# Altium schematic sheet A1.SchDoc: Название платы
size 840 x 594 mm; ApprovedBy: Рогов; CheckedBy: Фамилия проверяющего; DrawnBy: Фамилия разработчика; DocumentNumber: Введите номер платы + Э3; SheetNumber: пусто если лист 1, иначе 1; SheetTotal: количество листов; Title1str: (вторая строка при необходимости); DocumentType: тип схемы; Format: A1; ImagePath: Введите номер платы
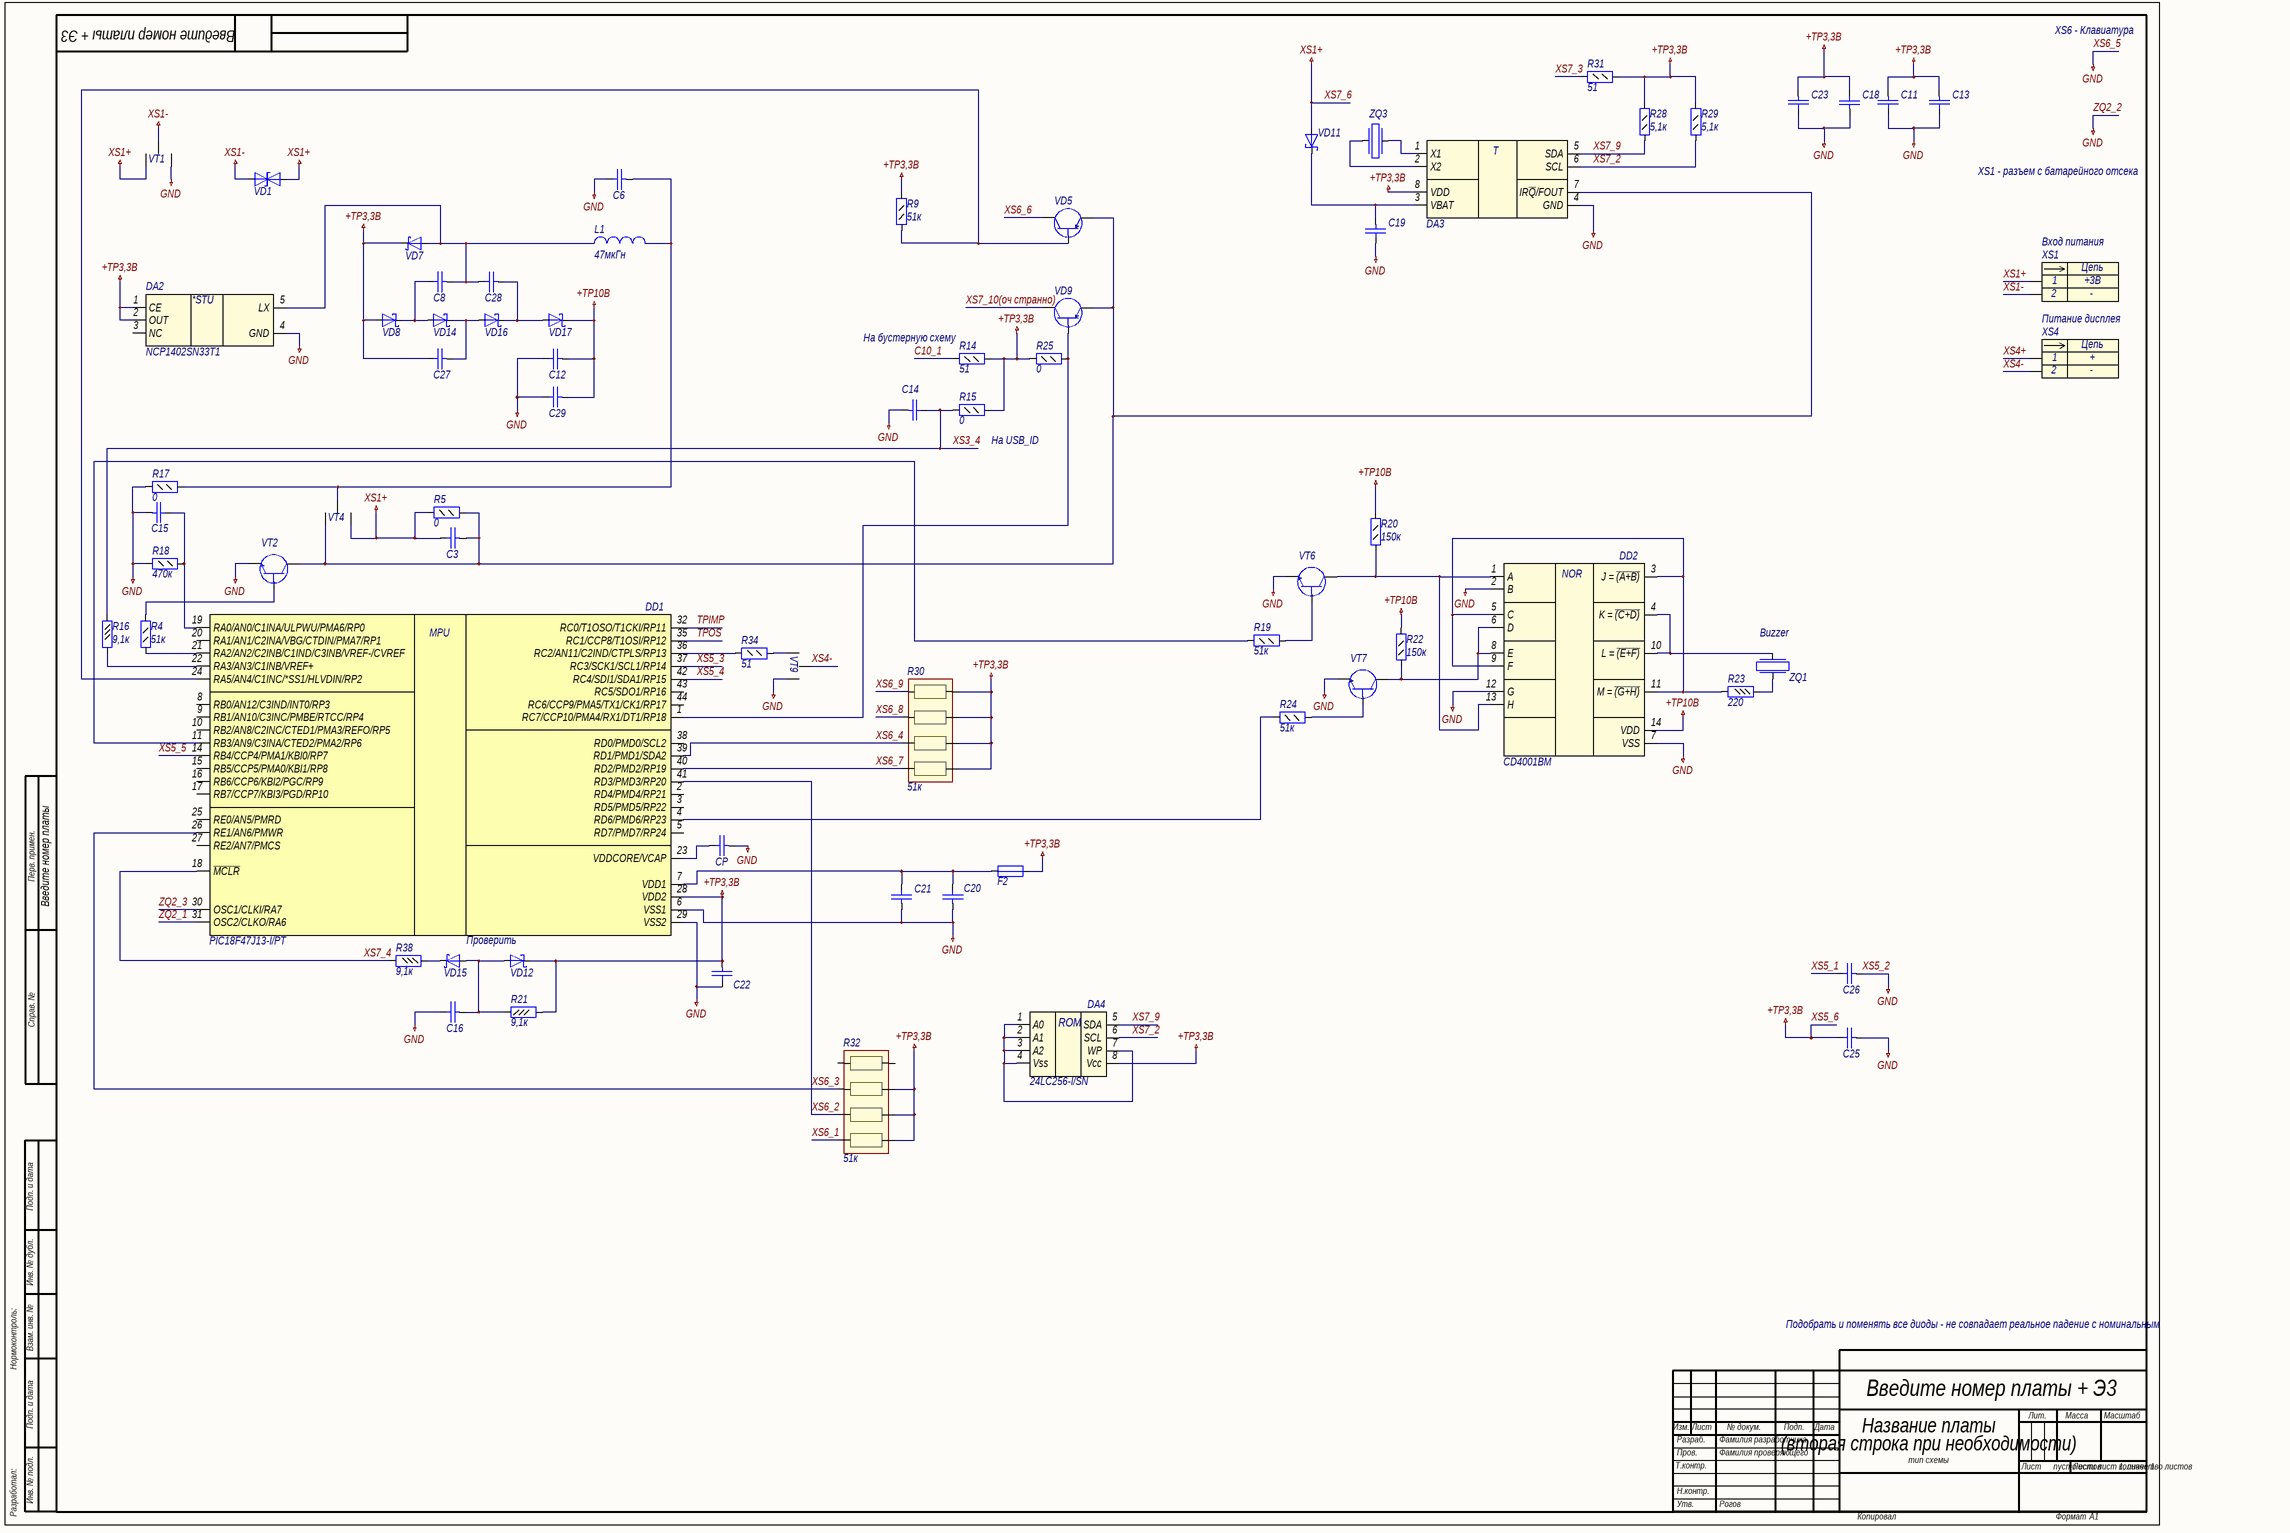
[diagram p0: A1.SchDoc]

## Parts
C3  Capacitor  [C0402]  (value not drawn)
C6  Capacitor  [C0402]  (value not drawn)
C8  Capacitor  [C0402]  (value not drawn)
C11  Capacitor  [C0402]  (value not drawn)
C12  Capacitor  [C0402]  (value not drawn)
C13  Capacitor  [C0402]  (value not drawn)
C14  Capacitor  [C0402]  (value not drawn)
C15  Capacitor  [C0402]  (value not drawn)
C16  Capacitor  [C0402]  (value not drawn)
C18  Capacitor  [C0402]  (value not drawn)
C19  Capacitor  [C0402]  (value not drawn)
C20  Capacitor  [C0402]  (value not drawn)
C21  Capacitor  [C0402]  (value not drawn)
C22  Capacitor  [C0402]  (value not drawn)
C23  Capacitor  [C0402]  (value not drawn)
C25  Capacitor  [C0402]  (value not drawn)
C26  Capacitor  [C0402]  (value not drawn)
C27  Capacitor  [C0402]  (value not drawn)
C28  Capacitor  [C0402]  (value not drawn)
C29  Capacitor  [C0402]  (value not drawn)
CP  Capacitor  [C0402]  (value not drawn)
DA2  Part Number: NCP1402SN33T1  [SOT23-5]  (hidden comment: NCP1402)
DA3  ISL1208IB8Z  [SO8]  (value not drawn)
DA4  24LC256-I/SN  [SO8]
DD1  PIC18F47J13-I/PT  [TQFP-44]
DD2  CD4001BM  [SO14]
F2  Fuse  [FUSE812]  (value not drawn)
L1  value 47мкГн  [SDR0604]  (hidden comment: Inductor)
R4  value 51к  [R0805]  (hidden comment: Resistor_0,125Вт)
R5  value 0  [R0805]  (hidden comment: Resistor_0,125Вт)
R9  value 51к  [R0805]  (hidden comment: Resistor_0,125Вт)
R14  value 51  [R0805]  (hidden comment: Resistor_0,125Вт)
R15  value 0  [R0805]  (hidden comment: Resistor_0,125Вт)
R16  value 9,1к  [R0603]  (hidden comment: Resistor_0,062Вт)
R17  value 0  [R0805]  (hidden comment: Resistor_0,125Вт)
R18  value 470к  [R0805]  (hidden comment: Resistor_0,125Вт)
R19  value 51к  [R0805]  (hidden comment: Resistor_0,125Вт)
R20  value 150к  [R0805]  (hidden comment: Resistor_0,125Вт)
R21  value 9,1к  [R0603]  (hidden comment: Resistor_0,062Вт)
R22  value 150к  [R0805]  (hidden comment: Resistor_0,125Вт)
R23  value 220  [R0603]  (hidden comment: Resistor_0,062Вт)
R24  value 51к  [R0805]  (hidden comment: Resistor_0,125Вт)
R25  value 0  [R0805]  (hidden comment: Resistor_0,125Вт)
R28  value 5,1к  [R0805]  (hidden comment: Resistor_0,125Вт)
R29  value 5,1к  [R0805]  (hidden comment: Resistor_0,125Вт)
R30  value 51к  [4xR1206]  (hidden comment: Resistors_array_4x0,062Вт)
R31  value 51  [R0805]  (hidden comment: Resistor_0,125Вт)
R32  value 51к  [4xR1206]  (hidden comment: Resistors_array_4x0,062Вт)
R34  value 51  [R0805]  (hidden comment: Resistor_0,125Вт)
R38  value 9,1к  [R0603]  (hidden comment: Resistor_0,062Вт)
VD1  DiodeZenerDual  [SMB]  (value not drawn)
VD5  BJT PNP  [SOT23-3]  (value not drawn)
VD7  DiodeSchottky  [SOD-123]  (value not drawn)
VD8  DiodeSchottky  [SOD-123]  (value not drawn)
VD9  BJT PNP  [SOT23-3]  (value not drawn)
VD11  DiodeSchottky  [SOD-123]  (value not drawn)
VD12  DiodeSchottky  [SOD-123]  (value not drawn)
VD14  DiodeSchottky  [SOD-123]  (value not drawn)
VD15  DiodeSchottky  [SOD-123]  (value not drawn)
VD16  DiodeSchottky  [SOD-123]  (value not drawn)
VD17  DiodeSchottky  [SOD-123]  (value not drawn)
VT2  BJT NPN  [SOT23-3]  (value not drawn)
VT6  BJT NPN  [SOT23-3]  (value not drawn)
VT7  BJT NPN  [SOT23-3]  (value not drawn)
XS1  Вход питания  [CWF-2]
XS4  Питание дисплея  [CWF-2]
ZQ1  (no value)  [Buzzer_9mm]
ZQ3  Crystal  [QSMD7x1.5x1.4]  (value not drawn)

## Nets
+TP10В: C12.1 C29.1 DD2.14(VDD) R20.2 R22.2 VD17.1(K)
XS1+: C3.2 R5.1 VD1.1(K) VD11.2(A) XS1.1  [also labelled XS7_6]
XS1-: VD1.2(A) XS1.2
XS5_2: C6.2 C11.2 C12.2 C13.2 C14.1 C15.1 C16.2 C18.1 C19.2 C20.1 C21.1 C22.2 C23.2 C25.1 C26.1 C29.2 CP.1 DA2.4(GND) DA3.4(GND) DD1.6(VSS1) DD1.29(VSS2) DD2.2(B) DD2.7(VSS) DD2.12(G) R17.1 R18.2 VT2.2 VT6.2 VT7.2  [also labelled GND, XS6_5, ZQ2_2]
XS5_6: C11.1 C13.1 C18.2 C22.1 C23.1 C25.2 C27.2 DA2.1(CE) DA2.2(OUT) DA3.8(VDD) DA4.8(Vcc) DD1.28(VDD2) F2.2 R9.2 R14.2 R15.2 R21.2 R25.1 R28.2 R29.2 R30.2 R30.4 R30.6 R30.8 R31.1 R32.4 R32.6 R32.8 VD7.1(K) VD8.2(A) VD12.1(K)  [also labelled +TP3,3В]
C10_1: R14.1
TPIMP: DD1.32(RC0/T1OSO/T1CKI/RP11)
TPOS: DD1.35(RC1/CCP8/T1OSI/RP12)
XS3_4: C14.2 R15.1 R16.1
XS4+: XS4.1
XS4-: XS4.2
XS5_1: C26.2
XS5_3: DD1.37(RC3/SCK1/SCL1/RP14)
XS5_4: DD1.42(RC4/SDI1/SDA1/RP15)
XS5_5: DD1.14(RB4/CCP4/PMA1/KBI0/RP7)
XS6_1: R32.7
XS6_2: DD1.26(RE1/AN6/PMWR) DD1.41(RD3/PMD3/RP20) R32.3 R32.5  [also labelled XS6_3]
XS6_4: DD1.39(RD1/PMD1/SDA2) R30.5
XS6_6: VD5.3
XS6_7: DD1.40(RD2/PMD2/RP19) R30.7
XS6_8: R30.3
XS6_9: R30.1
XS7_2: DA3.6(SCL) DA4.6(SCL) R29.1
XS7_3: R31.2
XS7_4: DD1.18(~{MCLR}) R38.2
XS7_9: DA3.5(SDA) DA4.5(SDA) R28.1
XS7_10(оч странно): VD9.3
ZQ2_1: DD1.31(OSC2/CLKO/RA6)
ZQ2_3: DD1.30(OSC1/CLKI/RA7)
NetC3_1: C3.1 DA3.7(IR~{Q}/FOUT) R5.2 VD5.2 VD9.2 VT2.3
NetC6_1: C6.1 L1.2 R17.2
NetC8_1: C8.1 C28.2 DA2.5(LX) L1.1 VD7.2(A)
NetC8_2: C8.2 VD8.1(K) VD14.2(A)
NetC15_2: C15.2 DD1.19(RA0/AN0/C1INA/ULPWU/PMA6/RP0) R18.1
NetC16_1: C16.1 R21.1 VD12.2(A) VD15.2(A)
NetC19_1: C19.1 DA3.3(VBAT) VD11.1(K)
NetC20_2: C20.2 C21.2 DD1.7(VDD1) F2.1
NetC27_1: C27.1 VD14.1(K) VD16.2(A)
NetC28_1: C28.1 VD16.1(K) VD17.2(A)
NetCP_2: CP.2 DD1.23(VDDCORE/VCAP)
NetDA3_1: DA3.1(X1) ZQ3.2
NetDA3_2: DA3.2(X2) ZQ3.1
NetDA4_1: DA4.1(A0) DA4.2(A1) DA4.3(A2) DA4.4(Vss) DA4.7(WP)
NetDD1_1: DD1.1(RC7/CCP10/PMA4/RX1/DT1/RP18) R25.2 VD9.1
NetDD1_4: DD1.4(RD6/PMD6/RP23) R24.1
NetDD1_11: DD1.11(RB3/AN9/C3INA/CTED2/PMA2/RP6) R19.1
NetDD1_21: DD1.21(RA2/AN2/C2INB/C1IND/C3INB/VREF-/CVREF) R4.1
NetDD1_22: DD1.22(RA3/AN3/C1INB/VREF+) R16.2
NetDD1_24: DD1.24(RA5/AN4/C1INC/*SS1/HLVDIN/RP2) R9.1 VD5.1
NetDD1_36: DD1.36(RC2/AN11/C2IND/CTPLS/RP13) R34.2
NetDD2_1: DD2.1(A) DD2.13(H) R20.1 VT6.3
NetDD2_3: DD2.3(J_=_~{(A+B)}) DD2.5(C) DD2.9(F) DD2.11(M_=_~{(G+H)}) R23.2
NetDD2_4: DD2.4(K_=_~{(C+D)}) DD2.10(L_=_~{(E+F)}) ZQ1.2
NetDD2_6: DD2.6(D) DD2.8(E) R22.1 VT7.3
NetR4_2: R4.2 VT2.1
NetR19_2: R19.2 VT6.1
NetR23_1: R23.1 ZQ1.1
NetR24_2: R24.2 VT7.1
NetR38_1: R38.1 VD15.1(K)

Not connected (* = marked no-connect by the designer): DA2 3(NC); DD1 2(RD4/PMD4/RP21) 3(RD5/PMD5/RP22) 5(RD7/PMD7/RP24) 8(RB0/AN12/C3IND/INT0/RP3) 9(RB1/AN10/C3INC/PMBE/RTCC/RP4) 10(RB2/AN8/C2INC/CTED1/PMA3/REFO/RP5) 15(RB5/CCP5/PMA0/KBI1/RP8) 16(RB6/CCP6/KBI2/PGC/RP9) 17(RB7/CCP7/KBI3/PGD/RP10) 20(RA1/AN1/C2INA/VBG/CTDIN/PMA7/RP1) 25(RE0/AN5/PMRD) 27(RE2/AN7/PMCS) 38(RD0/PMD0/SCL2) 43(RC5/SDO1/RP16) 44(RC6/CCP9/PMA5/TX1/CK1/RP17); R32 1 2; R34 1

## Notes on the sheet
- XS6 - Клавиатура
- VT1
- XS1 - разъем с батарейного отсека
- (near R14) На бустерную схему
- На USB_ID
- VT4
- (near R34) VT9
- (near ZQ1) Buzzer
- Перв. примен.
- Проверить
- Справ. №
- Подп. и дата
- Инв. № дубл.
- Нормоконтроль:
- Взам. инв. №
- Подобрать и поменять все диоды - не совпадает реальное падение с номинальным
- Изм.
- Лист
- № докум.
- Подп.
- Дата
- Лит.
- Масса
- Масштаб
- Т.контр.
- Пров.
- Разраб.
- Листов
- Разработал:
- Инв. № подл.
- Н.контр.
- Утв.
- Копировал
- Формат
- (in symbol 24LC256-I/SN) ROM
- (in symbol connect15) Цепь
- (in symbol logic10) NOR
- (in symbol logic14) T
- (in symbol microcont9) MPU
- (in symbol pwr18) *STU

## Library data of the parts
C3 C6 C8 C11-C16 C18-C23 C25-C29 CP = cap0: Конденсатор; Part Name: Ceramic; Manufacture: Murata; Part Number: GRP1555C1HR47CZ01E; Voltage: 50B; id: cap0; TKE: NP0; Value: ?
DA2 = pwr18: Step-up DC-DC Converter for 2-V to 3.3-V; Part Name: Step−up DC−DC Converter; Manufacturer: ON Semiconductor; id: pwr18; Input Voltage: 2В; Output Voltage: 3,3В; Current: 200mA; Type: Linear
DA3 = logic14: Часы реального времени/календарь; Part Name: Real Time Clock/Calendar; Manufacture: Intersil; Power Supply: 2,7В-5,5B; id: logic14; Part Number: ISL1208IB8Z
DA4 = 24LC256-I/SN: Последовательная энергонезависимая память 32x8kbit; Part Name: EEPROM; Manufacturer: Microchip; id: rom0; Frequency: 400kHz; Access Time: 900ns; Write Time: 5ms; Interface: i2c; Power Supply: 2.5-5.5 V; Part Number: 24LC256-I/SN; Memory Size: 32x8kbit
DD1 = microcont9: Микроконтроллер 8-Бит, 44-pin; Part Name: Microcontroller; Frequency: 48MHz; ADC: 13x12b; Interface: spi, i2c, euart, rs-485, rs-232, lin/j2602,; Flash: 128kb; Pin in: 25; Power Supply: 2,0-3,6В; id: microcont9; Part Number: PIC18F47J13-I/PT
DD2 = logic10: CMOS NOR Gate 4-Element 2-IN; Part Name: CMOS 4-NOR Gates; Manufacture: Texas Instruments; Number of elements: 4; Logic High Level: 3,5-11В; Logic Low Level: 1,5-4В; Toff: 90; Power Supply: 3-18В; id: logic10; Type of Logic: CMOS; Ton: 90; Part Number: CD4001BM
F2 = fuse0: Предохранитель; Part Name: Resettable Fuses; Manufacture: Bourns; Part Number: MF-MSMF075; id: fuse0; V max: 13,2B; I max: 100A; I hold: 0,75A; I trip: 1,5A; Resistance: 0,45Ohms
L1 = ind50: EMI Suppression Filter; Part Name: SMD Power Inductors; Part Number: SDR0604- 470KL; Manufacture: Bourns; Rated Current: 0,72A; id: ind50; Saturation Current: 1,0A; Resistance: 0,37Ohm
R4 R9 R19 R24 = res114: Резистор; Manufacture: Yageo; Part Number: RC0805FR-0751KL; id: res114; Accuracy: 0.01; Part Name: Resistor; Power: 0,125Вт
R5 R15 R17 R25 = res0: Резистор; Manufacture: Yageo; Part Number: RC0805FR-070RL; id: res0; Accuracy: 1%; Part Name: Resistor; Power: 0,125Вт
R14 R31 R34 = res42: Резистор; Manufacture: Yageo; Part Number: RC0805FR-0751RL; id: res42; Accuracy: 0.01; Part Name: Resistor; Power: 0,125Вт
R16 R21 R38 = res482: Резистор; Manufacture: Yageo; Part Number: RC0603FR-079K1; id: res482; Accuracy: 1%; Part Name: Resistor; Power: 0,062Вт
R18 = res137: Резистор; Manufacture: Yageo; Part Number: RC0805FR-07470KL; id: res137; Accuracy: 0.01; Part Name: Resistor; Power: 0,125Вт
R20 R22 = res125: Резистор; Manufacture: Yageo; Part Number: RC0805FR-07150KL; id: res125; Accuracy: 0.01; Part Name: Resistor; Power: 0,125Вт
R23 = res443: Резистор; Manufacture: Yageo; Part Number: RC0603FR-07220RL; id: res443; Accuracy: 1%; Part Name: Resistor; Power: 0,062Вт
R28 R29 = res90: Резистор; Manufacture: Yageo; Part Number: RC0805FR-075K1; id: res90; Accuracy: 0.01; Part Name: Resistor; Power: 0,125Вт
R30 R32 = res972: Резисторная сборка; Part Name: Resistor Arrays; Manufacture: Yageo; Part Number: TC164-JR-0751KL; id: res972; Accuracy: 0.05; Power: 0,062Вт
VD1 = SMBJ8.5CA: Cтабилитрон (диод выпрямительный лавинный) двусторонний; Part Name: TVS diode Bidirectional; Manufacture: ST Microelectronics; id: tvs43; Leakage Current: 0,2uA; Stand-off Voltage: 8,5B; Breakdown Voltage: 9,9B; Clamping voltage: 14,4B; Dynamic resistance: 0,096Ohm; Peak Pulse Power: 600W; Number of diodes: 1; Part Number: SMBJ8.5CA
VD5 VD9 = bjt8: Part Name: Transistor; Part Number: BC807-40; Manufacture: Taiwan Semiconductor; id: bjt8; hfe: 250-600; Vceo max: 45B; Ic max: 0,5A; Power: 0,31Вт; Icpeak max: 1A; Frequency: 100МГц; Structure: pnp
VD7 VD8 VD12 VD14-VD17 = diode16: Диод Шоттки; Part Number: MBR0520LT1; Manufacture: ON Semiconductor; Max Reverse Voltage: 20B; Forward Voltage: 0,385B; Forward Current: 0,5А; Breakdown Current: 5,5А; Capacitance: 10pF; Number of Channels: 1; id: diode16; Part Name: Diode Schottky
VD11 = diode15: Диод Шоттки; Part Number: MBR0540; Manufacture: ON Semiconductor; Max Reverse Voltage: 40B; Forward Voltage: 0,62B; Forward Current: 0,5А; Capacitance: 30pF; Number of Channels: 1; id: diode15; Part Name: Diode Schottky
VT2 VT6 VT7 = bjt7: Part Name: Transistor; Part Number: BC847C; id: bjt7; hfe: 420-800; Vceo max: 45B; Ic max: 100mA; Power: 0,25Bт; Icpeak max: 200mA; Frequency: 100МГц; Structure: npn
XS1 = connect15: Разъем - 2 конт. вилка; Part Number: DS1069-2MVW6X; Manufacture: Ningbo connfly electronic; Contact_1: +3В; Etch: 2,5mm; Contact_2: -; Name: Вход питания; Part Name: CWF-2; id: connect15
XS4 = connect15: Разъем - 2 конт. вилка; Part Number: DS1069-2MVW6X; Manufacture: Ningbo connfly electronic; Contact_1: +; Etch: 2,5mm; Contact_2: -; Name: Питание дисплея; Part Name: CWF-2; id: connect15
ZQ1 = buzzer0: Пьезоизлучатель звуковой без генератора; Part Number: HC0905F; Frequence: 3200Hz; Generator: no; Intensity: 85dB; Resistance: 40Ohm; Supply Voltage: 5B; Max  Current: 80mA; id: buzzer0
ZQ3 = crystal10: Кварцевый резонатор; Manufacture: GEYER; Part Number: KX-327LT; Frequence: 32.768kHz; id: crystal10